# Altium project Base Station v1.PrjPcb
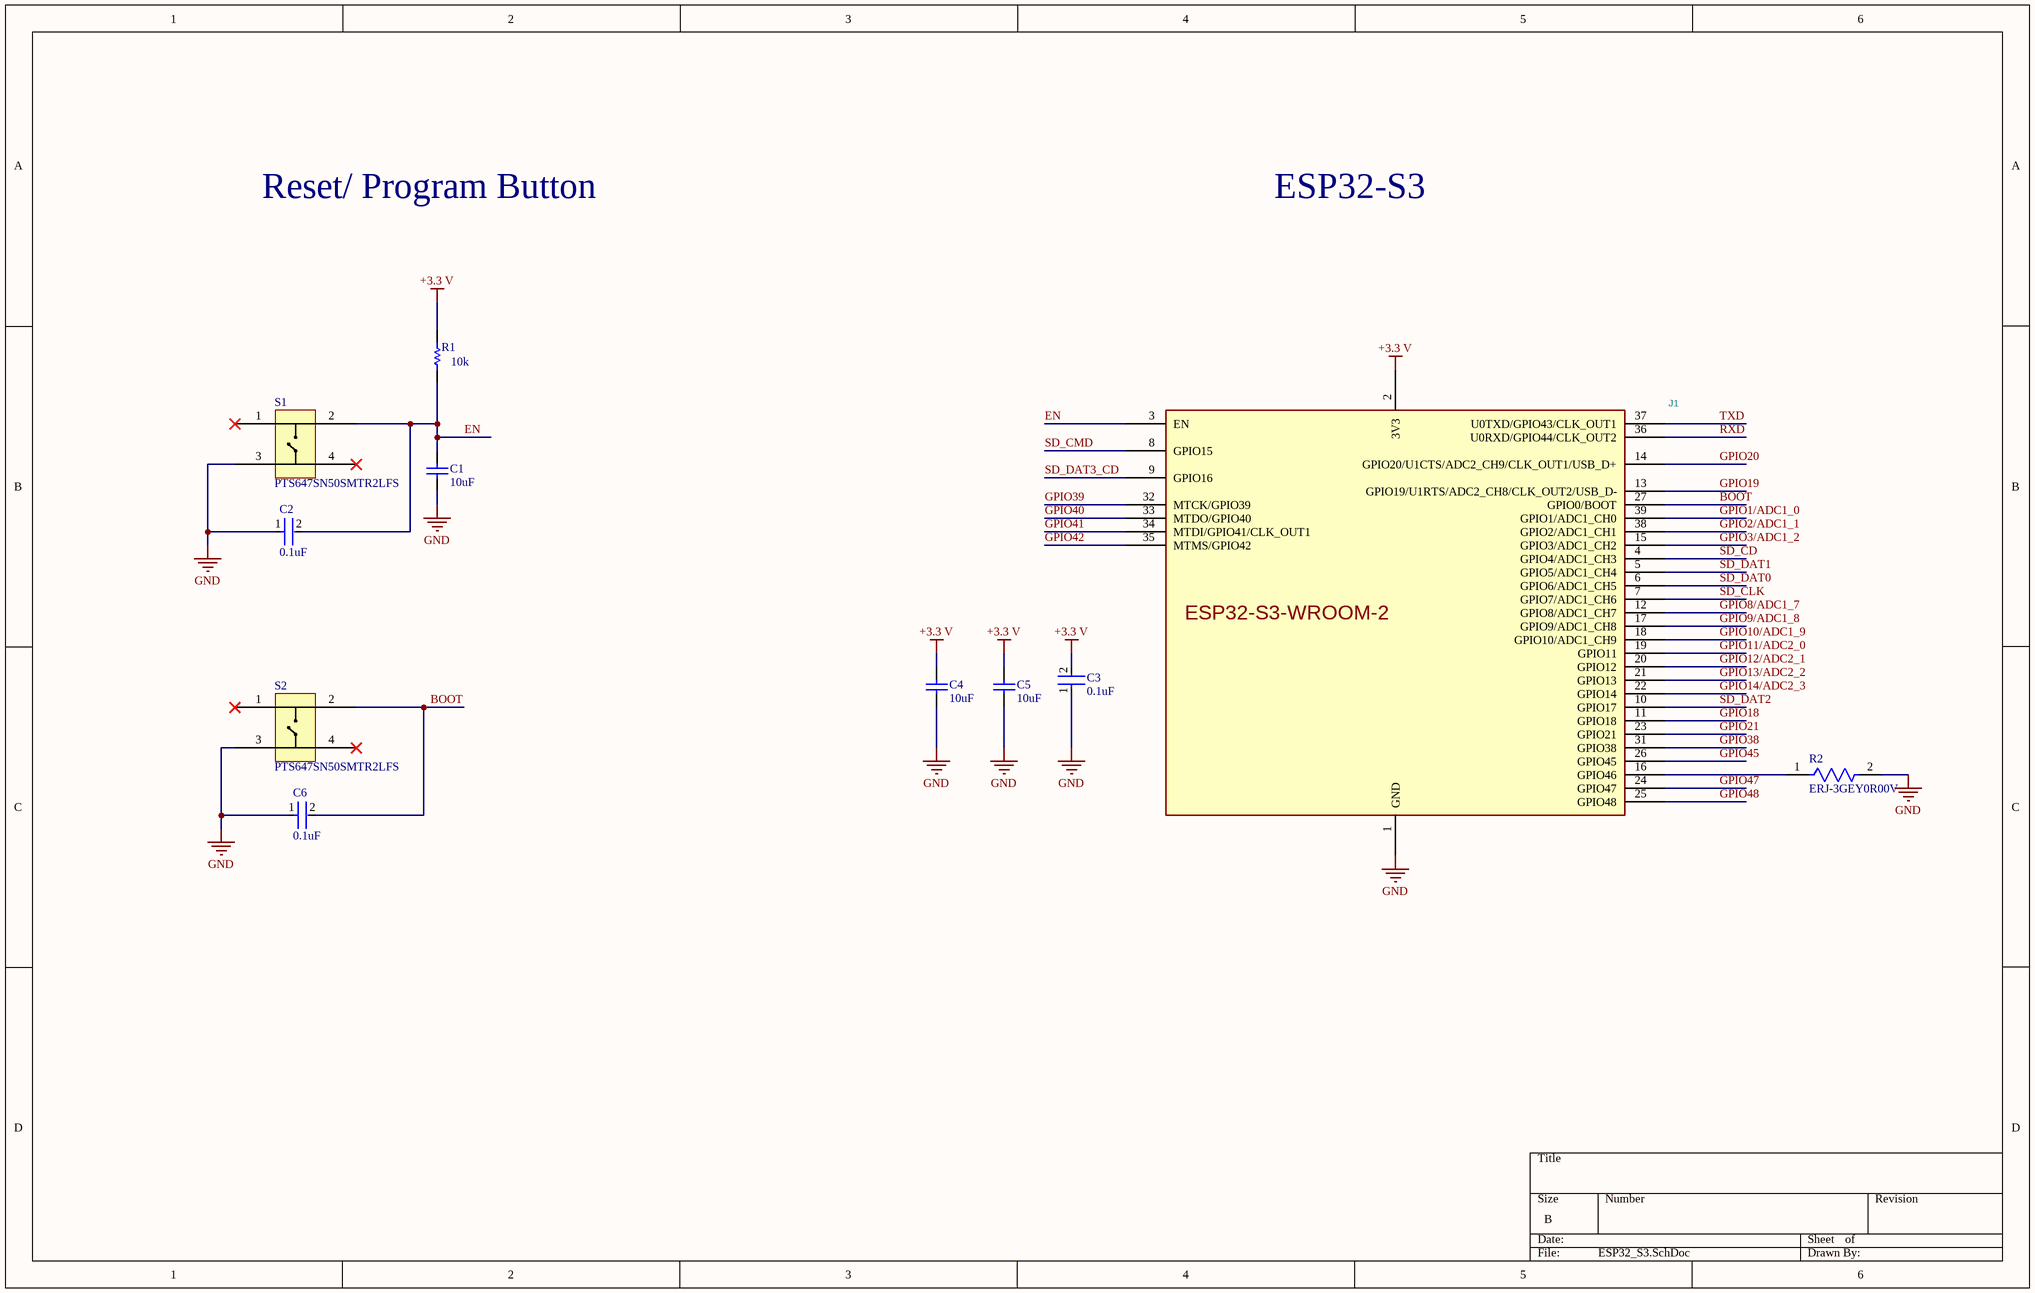
[diagram p0: ESP32_S3.SchDoc]
4 sheets, 51 parts. Net scope: global (net labels, ports and power ports of the same name join across sheets).
Board file: Base Station v1.PcbDoc
Sheets:
  ESP32_S3.SchDoc
  IO.SchDoc
  Power and CAN Bus.SchDoc
  CAN Bus Network.SchDoc

## Sheet ESP32_S3.SchDoc
size B; SheetNumber: 1; SheetTotal: 4

### Parts
C1  10uF  [CC0805ZKY5V6BB106-Footprint-1]
C2  0.1uF  [FP-CC0603-DA-IPC_A]
C3  0.1uF  [FP-CC0603-DA-IPC_A]
C4  10uF  [CC0805ZKY5V6BB106-Footprint-1]
C5  10uF  [CC0805ZKY5V6BB106-Footprint-1]
C6  0.1uF  [FP-CC0603-DA-IPC_A]
J1  ESP32-S3-WROOM-2  [ESP32-S3-WROOM-2]  (value not drawn)
R1  10k  [RESC2013X60X35ML10T20]
R2  ERJ-3GEY0R00V  [FP-ERJ-3GEY0R00V-IPC_A]
S1  PTS647SN50SMTR2LFS  [PTS647SN50SMTR2LFS-Footprint-1]
S2  PTS647SN50SMTR2LFS  [PTS647SN50SMTR2LFS-Footprint-1]

### Nets
+3.3 V: C3.2 C4.2 C5.2 J1.2(3V3) R1.2
GND: C1.1 C2.1 C3.1 C4.1 C5.1 C6.1 J1.1(GND) R2.2 S1.3 S2.3
BOOT: C6.2 J1.27(GPIO0/BOOT) S2.2
EN: C1.2 C2.2 J1.3(EN) R1.1 S1.2
GPIO1/ADC1_0: J1.39(GPIO1/ADC1_CH0)
GPIO2/ADC1_1: J1.38(GPIO2/ADC1_CH1)
GPIO3/ADC1_2: J1.15(GPIO3/ADC1_CH2)
GPIO8/ADC1_7: J1.12(GPIO8/ADC1_CH7)
GPIO9/ADC1_8: J1.17(GPIO9/ADC1_CH8)
GPIO10/ADC1_9: J1.18(GPIO10/ADC1_CH9)
GPIO11/ADC2_0: J1.19(GPIO11)
GPIO12/ADC2_1: J1.20(GPIO12)
GPIO13/ADC2_2: J1.21(GPIO13)
GPIO14/ADC2_3: J1.22(GPIO14)
GPIO18: J1.11(GPIO18)
GPIO19: J1.13(GPIO19/U1RTS/ADC2_CH8/CLK_OUT2/USB_D-)
GPIO20: J1.14(GPIO20/U1CTS/ADC2_CH9/CLK_OUT1/USB_D+)
GPIO21: J1.23(GPIO21)
GPIO38: J1.31(GPIO38)
GPIO39: J1.32(MTCK/GPIO39)
GPIO40: J1.33(MTDO/GPIO40)
GPIO41: J1.34(MTDI/GPIO41/CLK_OUT1)
GPIO42: J1.35(MTMS/GPIO42)
GPIO45: J1.26(GPIO45)
GPIO47: J1.24(GPIO47)
GPIO48: J1.25(GPIO48)
RXD: J1.36(U0RXD/GPIO44/CLK_OUT2)
SD_CD: J1.4(GPIO4/ADC1_CH3)
SD_CLK: J1.7(GPIO7/ADC1_CH6)
SD_CMD: J1.8(GPIO15)
SD_DAT0: J1.6(GPIO6/ADC1_CH5)
SD_DAT1: J1.5(GPIO5/ADC1_CH4)
SD_DAT2: J1.10(GPIO17)
SD_DAT3_CD: J1.9(GPIO16)
TXD: J1.37(U0TXD/GPIO43/CLK_OUT1)
NetJ1_16: J1.16(GPIO46) R2.1

Not connected (* = marked no-connect by the designer): J1 28(NC) 29(NC) 30(NC) 40(GND) 41(GND); S1 1* 4*; S2 1* 4*

### Notes on the sheet
- Reset/ Program Button
- ESP32-S3

### Library data of the parts
C1 C4 C5 = CMP-00010-2: Ceramic Capacitor, Multilayer, Ceramic, 10V, 80% +Tol, 20% -Tol, Y5V, -82/+22% TC, 10uF, Surface Mount, 0805; Multilayer: Yes; Min Operating Temperature: -30°C; Case/Package: 0805; Package Shape: Rectangular; RoHS Compliant: Yes; Termination: Wraparound; Package Style: SMTMeter; Packaging: Tape and Reel; Temperature Characteristics Code: Y5V; Pins: 2; Capacitor Type: Ceramic; Terminal Finish: Nickel; Tolerance (fill in as +-): 80%; Value: 10uF; Max Operating Temperature: 85°C; Length: 2mm; Width: 1.25mm; Dielectric Material: Ceramic; JESD-609 Code: e3; Reach SVHC Compliant: Yes; Height: 1.25mm; Tolerance  (fill in as +-): 20%; Mounting Technology: Surface Mount; Rated DC Voltage (URdc): 10V
C2 C3 C6 = CMP-00002-1: Ceramic Capacitor, Multilayer, Ceramic, 50V, 10% +Tol, 10% -Tol, X7R, 15% TC, 0.1uF, Surface Mount, 0603; Value: 100nF; Multilayer: Yes; Reach SVHC Compliant: Yes; Temperature Characteristics Code: X7R; Package Style: SMTMeter; Max Operating Temperature: 125°C; Dielectric Material: Ceramic; Mounting Technology: Surface Mount; Packaging: Tape and Reel; Width: 0.8mm; Min Operating Temperature: -55°C; Height: 0.8mm; RoHS Compliant: Yes; Rated DC Voltage (URdc): 50V; Tolerance (fill in as +-): 10%; Terminal Finish: Nickel; Case/Package: 0603; Length: 1.6mm; Tolerance  (fill in as +-): 10%; JESD-609 Code: e3; Package Shape: Rectangular; Capacitor Type: Ceramic; Pins: 2; Termination: Wraparound
J1 = CMP-024-000000-6: Reference: U; ki_description: 2.4 GHz WiFi (802.11 b/g/n) and Bluetooth ® 5 (LE) module Built around ESP32S3 series of SoCs, Xtensa ® dualcore 32bit LX7 microprocessor Flash up to 16 MB, PSRAM up to 8 MB 36 GPIOs, rich set of peripherals Onboard PCB antenna; Value: ESP32-S3-WROOM-2; Source: ESP32S3.SchLib; Datasheet: https://www.espressif.com/sites/default/files/documentation/esp32-s3-wroom-2_datasheet_en.pdf; Design Item ID: ESP32-S3-WROOM-2
R1 = CMP-00012-1: Fixed Resistor, Metal Glaze/thick Film, 0.125W, 10000ohm, 150V, 1% +/-Tol, 100ppm/Cel, Surface Mount, 0805; Package Width: 1.25mm; Rated Temperature: 70°C; Package Height: 0.5mm; Power: 125mW; Additional Feature: LASER TRIMMABLE; Temperature Coefficient: 100ppm/°C; Value: 10kR; Package Length: 2mm; Min Operating Temperature: -55°C; Working Voltage: 150V; Case/Package: 0805; Construction: Chip; Termination: Wraparound; Package Shape: Rectangular; Packaging: Tape and Reel; Technology: METAL GLAZE/THICK FILM; RoHS Compliant: Yes; Tolerance: 1%; Reach SVHC Compliant: Yes; Mounting Technology: Surface Mount; Pins: 2; Terminal Finish: Nickel; JESD-609 Code: e3; Max Operating Temperature: 155°C; Package Style: SMTMeter; Resistor Type: FIXED RESISTOR
R2 = CMP-00039-1: Fixed Resistor, Metal Glaze/thick Film, 0.1W, 0ohm, Surface Mount, 0603; Reference Standard: AEC-Q200; Power: 100mW; Rated Temperature: 70°C; Value: 0R; Package Height: 0.45mm; Package Width: 0.8mm; Package Length: 1.6mm; Package Style: SMTMeter; Mounting Technology: Surface Mount; Construction: Rectangular; Case/Package: 0603; Packaging: Tape and Reel; Resistor Type: FIXED RESISTOR; Reach SVHC Compliant: Yes; JESD-609 Code: e3; Package Shape: Rectangular; Technology: METAL GLAZE/THICK FILM; Min Operating Temperature: -55°C; Max Operating Temperature: 155°C; Pins: 2; Termination: Wraparound; Terminal Finish: Nickel; RoHS Compliant: Yes
S1 S2 = CMP-011-00013-3: Keypad Switch, 1 Switches, SPST, Momentary-tactile, 0.05A, 12VDC, 1.47N, Solder Terminal, Surface Mount-straight; RoHS Compliant: Yes

## Sheet IO.SchDoc
size B; SheetNumber: 2; SheetTotal: 4
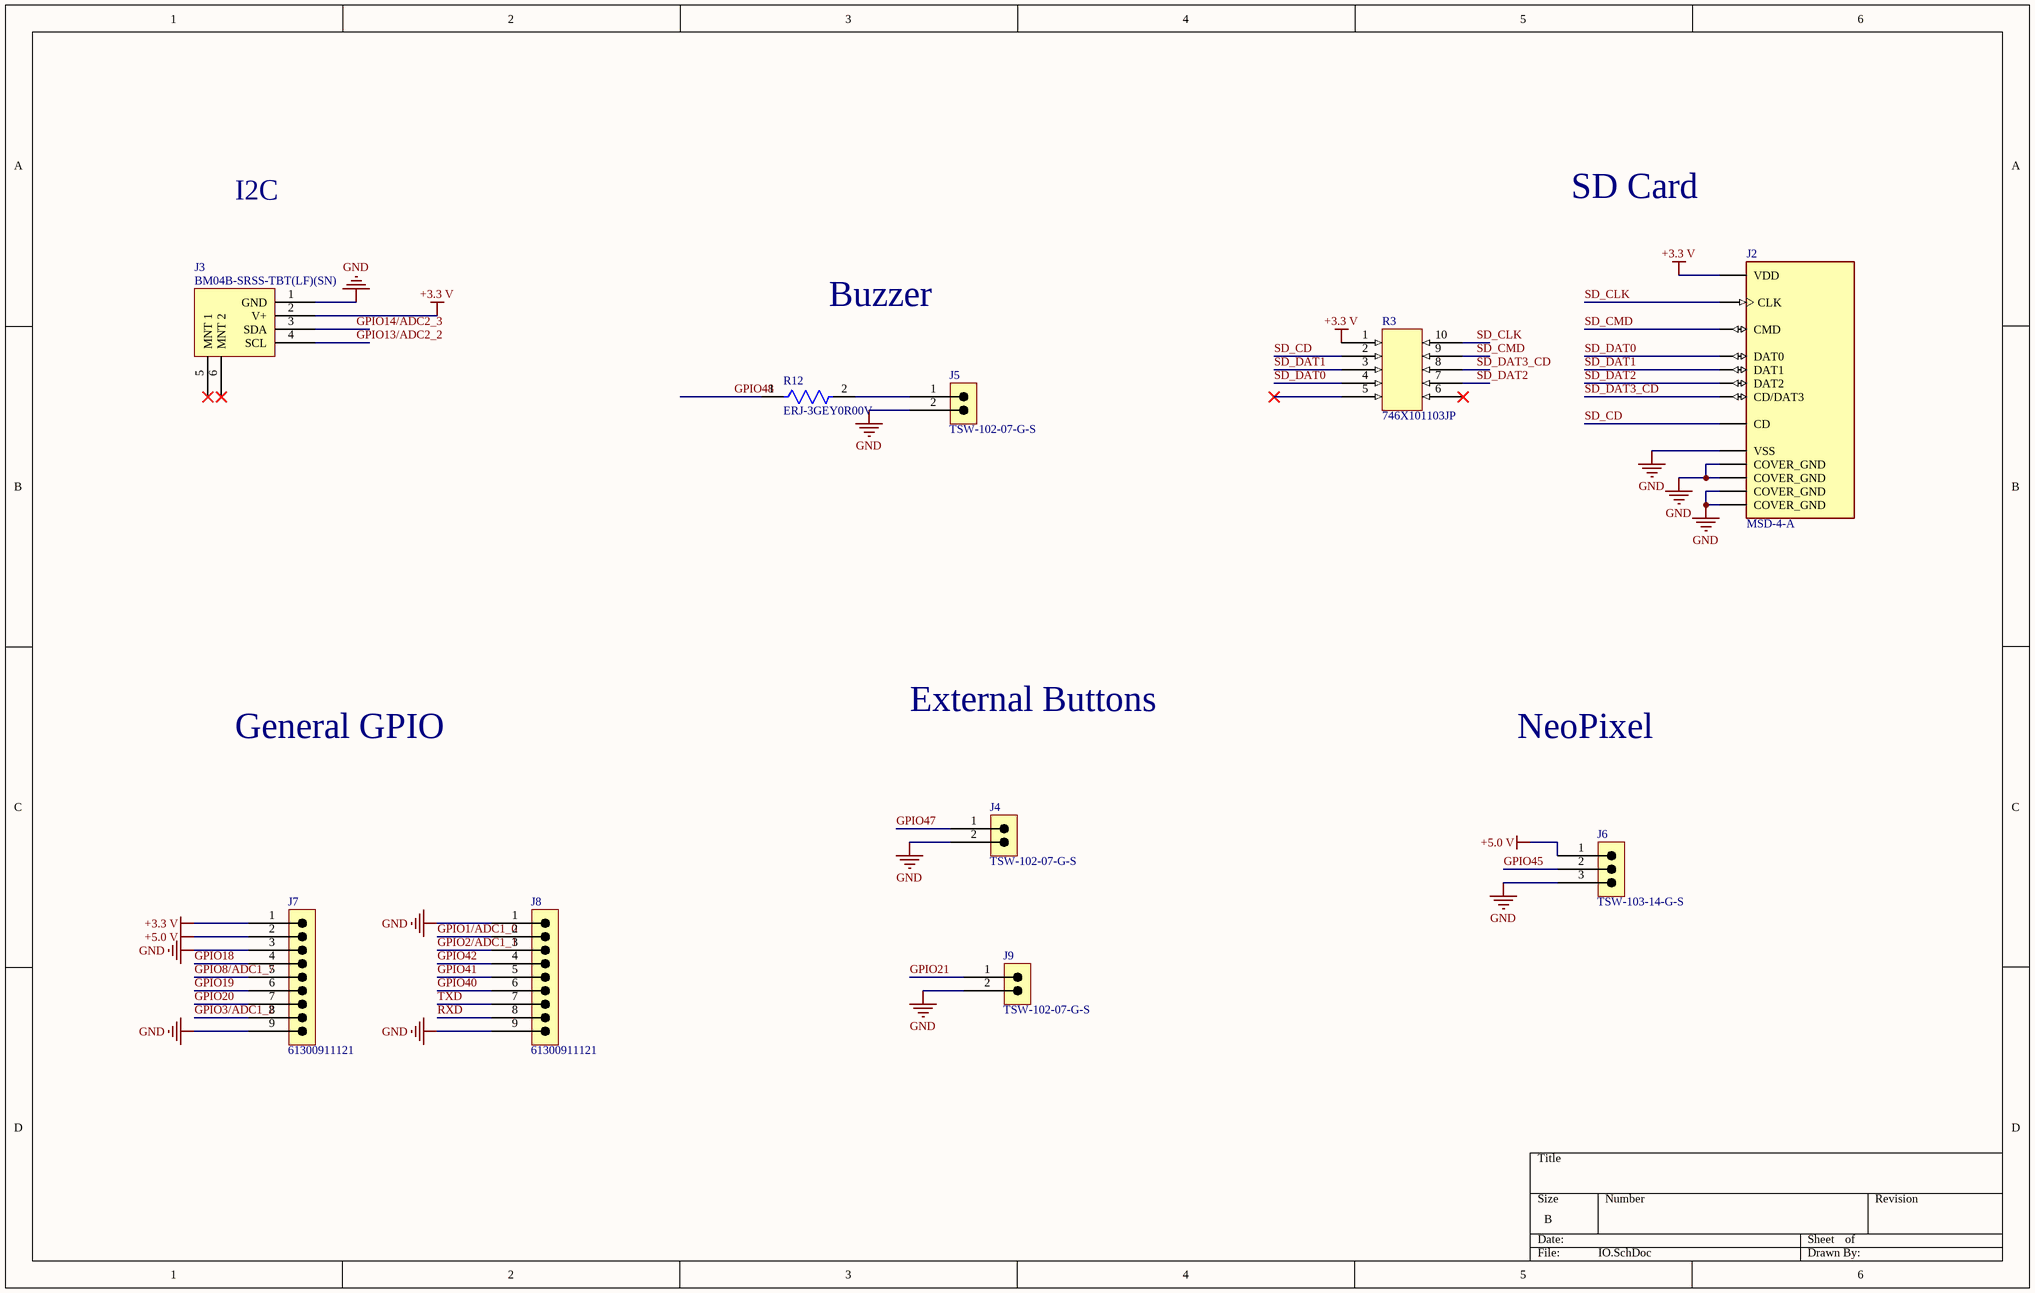
[diagram p1: IO.SchDoc]

### Parts
J2  MSD-4-A  [CUI_MSD-4-A]
J3  BM04B-SRSS-TBT(LF)(SN)  [FP-BM04B-SRSS-TBT_LF_SN-MFG]
J4  TSW-102-07-G-S  [FP-TSW-102-07-G-S-MFG]
J5  TSW-102-07-G-S  [FP-TSW-102-07-G-S-MFG]
J6  TSW-103-14-G-S  [FP-TSW-103-14-G-S-MFG]
J7  61300911121  [61300911121]
J8  61300911121  [61300911121]
J9  TSW-102-07-G-S  [FP-TSW-102-07-G-S-MFG]
R3  746X101103JP  [CAF-127P640X310-10N]
R12  ERJ-3GEY0R00V  [FP-ERJ-3GEY0R00V-IPC_A]

### Nets
+3.3 V: J2.4(VDD) J3.2(V+) J7.1 R3.1
+5.0 V: J6.1 J7.2
GND: J2.6(VSS) J2.G1(COVER_GND) J2.G2(COVER_GND) J2.G3(COVER_GND) J2.G4(COVER_GND) J3.1(GND) J4.2 J5.2 J6.3 J7.3 J7.9 J8.1 J8.9 J9.2
GPIO1/ADC1_0: J8.2
GPIO2/ADC1_1: J8.3
GPIO3/ADC1_2: J7.8
GPIO8/ADC1_7: J7.5
GPIO13/ADC2_2: J3.4(SCL)
GPIO14/ADC2_3: J3.3(SDA)
GPIO18: J7.4
GPIO19: J7.6
GPIO20: J7.7
GPIO21: J9.1
GPIO40: J8.6
GPIO41: J8.5
GPIO42: J8.4
GPIO45: J6.2
GPIO47: J4.1
GPIO48: R12.1
RXD: J8.8
SD_CD: J2.CD R3.2
SD_CLK: J2.5(CLK) R3.10
SD_CMD: J2.3(CMD) R3.9
SD_DAT0: J2.7(DAT0) R3.4
SD_DAT1: J2.8(DAT1) R3.3
SD_DAT2: J2.1(DAT2) R3.7
SD_DAT3_CD: J2.2(CD/DAT3) R3.8
TXD: J8.7
NetJ5_1: J5.1 R12.2

Not connected (* = marked no-connect by the designer): J3 5(MNT_1)* 6(MNT_2)*; R3 5* 6*

### Notes on the sheet
- I2C
- SD Card
- Buzzer
- General GPIO
- External Buttons
- NeoPixel

### Library data of the parts
J2 = CMP-002-00078-2: Micro SD Card Connector, 9 Positions, Connector and Ejector, Push In, Auto Eject Out, Surface Mount, 1.8 mm Height Above Board, Gold Flash; MF: CUI Devices; Source: MSD-4-A.SchLib; CUI_purchase_URL: https://www.cuidevices.com/product/interconnect/connectors/memory-card-connectors/sd-card-connectors/msd-4-a?utm_source=snapeda.com&utm_medium=referral&utm_campaign=snapedaBOM; Component Type: Standard; Value: *; Case/Package: None; SnapEDA_Link: https://www.snapeda.com/parts/MSD-4-A/CUI+Devices/view-part/?ref=snap; Pins: 13; MP: MSD-4-A; Check_prices: https://www.snapeda.com/parts/MSD-4-A/CUI+Devices/view-part/?ref=eda; Design Item ID: MSD-4-A
J3 = CMP-002-00076-4: 1.0mm Pitch, Ultra-Compact, Low Profile Design, Interchangeable Shrouded Header
J4 J5 J9 = CMP-00020-2: Board Connector, 2 Contact(s), 1 Row(s), Male, Straight, 0.1 inch Pitch, Solder Terminal, Black Insulator; Additional Feature: E.L.P.; Mixed Contacts: No; Plating Thickness: 10uin; Reliability: COMMERCIAL; Number of Rows Loaded: 1; Option: General Purpose; Number of Contacts: 2; Body/Shell Style: RECEPTACLE; PCB Contact Pattern: RECTANGULAR; Contact Style: SQ PIN-SKT; Mating Information: MULTIPLE MATING PARTS AVAILABLE; Reference Standard: UL; Mating Contact Pitch: 0.1inch; DIN Conformance: No; Terminal Length: 0.1inch; Flammability Rating: UL94 V-0; Body Depth: 0.1inch; Contact Finish - Termination: Gold (Au) - with Nickel (Ni) barrier; Body Breadth: 0.1inch; Reach SVHC Compliant: Yes; MIL Conformance: No; Contact Pattern: RECTANGULAR; Termination: Solder; Insulation Material: Glass; Insulation Color: Black; Terminal Pitch: 2.54mm; Filter Feature: No; Connector Type: BOARD CONNECTOR; Mounting Style: STRAIGHT; Contact Material: Bronze; Number Of Connectors: 1; Number Of PCB Rows: 1; IEC Conformance: No; Contact Finish - Mating: GOLD (10) OVER NICKEL (50); JESD-609 Code: e4; RoHS Compliant: Yes; Contact Gender: Male; Mounting Technology: Board
J6 = CMP-00025-3: Board Connector, 3 Contact(s), 1 Row(s), Male, Straight, 0.1 inch Pitch, Solder Terminal, Black Insulator, Receptacle; Additional Feature: E.L.P.; MIL Conformance: No; PCB Contact Pattern: RECTANGULAR; Mating Information: MULTIPLE MATING PARTS AVAILABLE; Number of Contacts: 3; Plating Thickness: 10uin; Reference Standard: UL; Reliability: COMMERCIAL; Contact Style: SQ PIN-SKT; Option: General Purpose; Number of Rows Loaded: 1; Contact Finish - Mating: GOLD (10) OVER NICKEL (50); Mounting Style: STRAIGHT; Reach SVHC Compliant: Yes; DIN Conformance: No; Filter Feature: No; Mixed Contacts: No; Body Depth: 0.1inch; Terminal Length: 0.11inch; Contact Pattern: RECTANGULAR; Contact Finish - Termination: Gold (Au) - with Nickel (Ni) barrier; Connector Type: BOARD CONNECTOR; Body Breadth: 0.1inch; Termination: Solder; Insulation Material: Glass; Body/Shell Style: RECEPTACLE; IEC Conformance: No; Insulation Color: Black; Contact Material: Bronze; RoHS Compliant: Yes; Mounting Technology: Board; Number Of Connectors: 1; Mating Contact Pitch: 0.1inch; JESD-609 Code: e4; Number Of PCB Rows: 1; Contact Gender: Male; Terminal Pitch: 2.54mm
J7 J8 = CMP-00023-4: Board Connector, 9 Contact(s), 1 Row(s), Male, Straight, 0.1 inch Pitch, Solder Terminal, Locking, Black Insulator, Plug; Rated Current (Signal): 3A; Body Length: 0.9inch; Reference Standard: UL; Reliability: COMMERCIAL; Contact Style: SQ PIN-SKT; PCB Contact Pattern: RECTANGULAR; Number of Contacts: 9; Insulation Resistance: 1GR; Dielectric Withstanding Voltage (AC): 500V; Number Of Connectors: 1; Contact Resistance: 20mR; Body/Shell Style: PLUG; Terminal Length: 0.118inch; Reach SVHC Compliant: Yes; Connector Type: BOARD CONNECTOR; Contact Finish - Termination: Gold (Au) - with Nickel (Ni) barrier; Body Depth: 0.1inch; Mounting Technology: Board; Terminal Pitch: 2.54mm; Body Breadth: 0.1inch; Max Operating Temperature: 125°C; Min Operating Temperature: -40°C; RoHS Compliant: Yes; Contact Material: Copper Alloy; Insulation Color: Black; Termination: Solder; Insulation Material: Polybutylene; Contact Finish - Mating: GOLD; Mounting Style: STRAIGHT; JESD-609 Code: e4; Mounting Option 1: LOCKING; Mating Contact Pitch: 0.1inch; Contact Pattern: RECTANGULAR; Number of Rows Loaded: 1; Contact Gender: Male
R3 = CMP-00038-1: Array/Network Resistor, Bussed, Metal Glaze/thick Film, 0.063W, 10000ohm, 25V, 5% +/-Tol, 200ppm/Cel, Surface Mount, 0612; Package Height: 0.6mm; Element Power Dissipation: 31mW; Value: 10kR; Package Length: 3.2mm; Number of Elements: 8; Package Width: 1.6mm; Rated Temperature: 70°C; Power: 248mW; Channels: 1; Temperature Coefficient: 200ppm/°C; Resistor Type: ARRAY/NETWORK RESISTOR; Working Voltage: 25V; RoHS Compliant: Yes; Min Operating Temperature: -55°C; Packaging: Tape and Reel; Package Style: SMTMeter; Case/Package: 0613; First Element Resistance: 10kR; Network Type: BUSSED; Package Shape: Rectangular; Reach SVHC Compliant: Yes; JESD-609 Code: e3; Pins: 10; Construction: Chip; Terminal Finish: Nickel; Mounting Technology: Surface Mount; Technology: METAL GLAZE/THICK FILM; Max Operating Temperature: 125°C; Termination: Wraparound; Tolerance: 5%
R12 = CMP-00039-1: as R2 on sheet ESP32_S3; Package Style: SMTMeter; Mounting Technology: Surface Mount; Construction: Rectangular; Case/Package: 0603; Packaging: Tape and Reel; Resistor Type: FIXED RESISTOR; Reach SVHC Compliant: Yes; JESD-609 Code: e3; Package Shape: Rectangular; Technology: METAL GLAZE/THICK FILM; Min Operating Temperature: -55°C; Max Operating Temperature: 155°C; Pins: 2; Termination: Wraparound; Terminal Finish: Nickel; RoHS Compliant: Yes

## Sheet Power and CAN Bus.SchDoc
size B; SheetNumber: 3; SheetTotal: 4
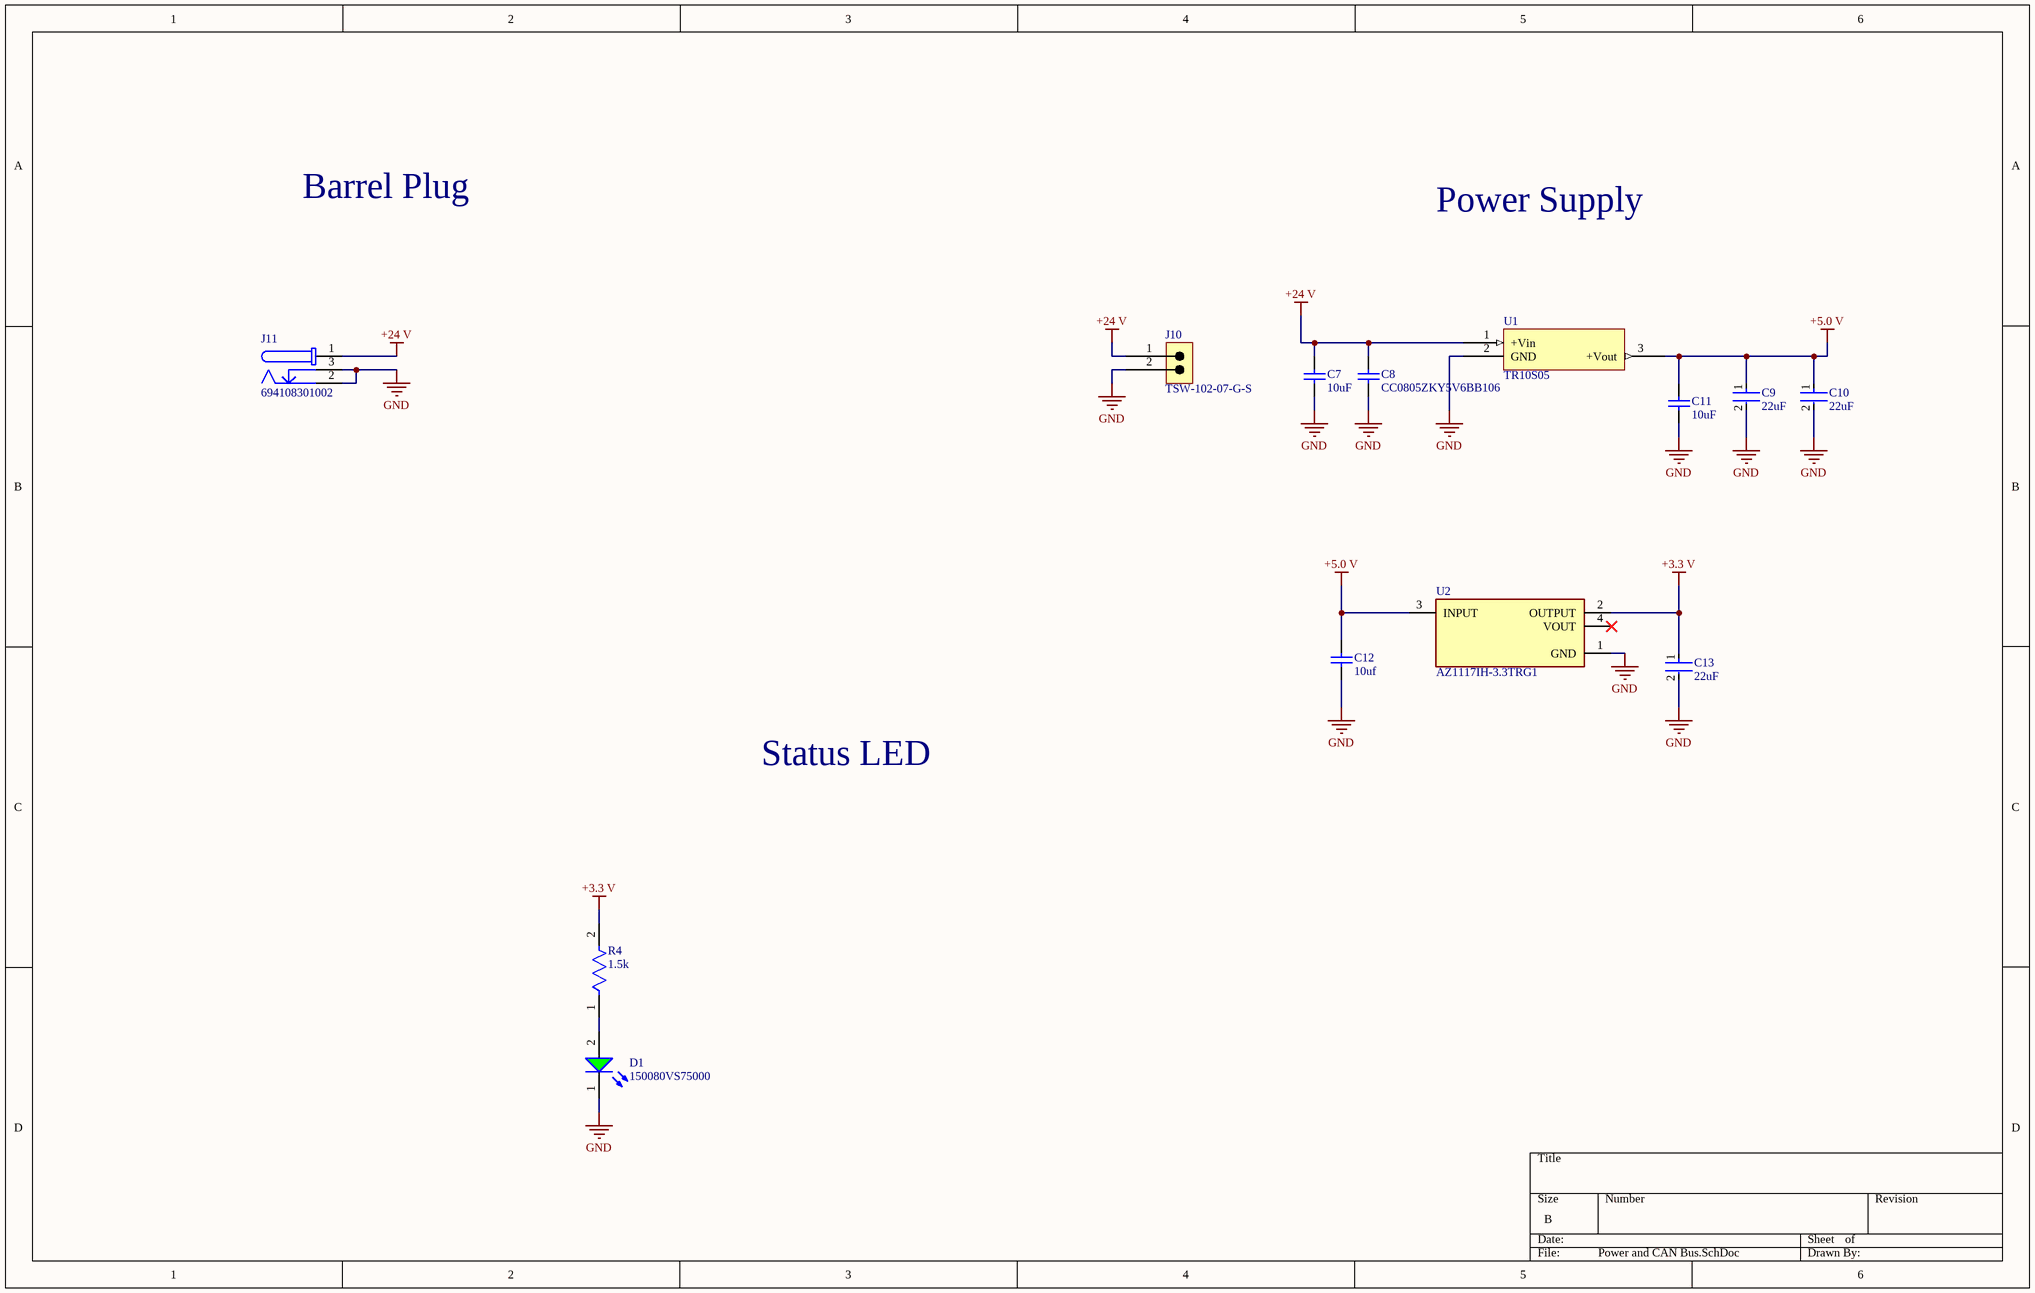
[diagram p2: Power and CAN Bus.SchDoc]

### Parts
C7  10uF  [CC0805ZKY5V6BB106-Footprint-1]
C8  CC0805ZKY5V6BB106  [CC0805ZKY5V6BB106-Footprint-1]
C9  22uF  [FP-GMC21R-IPC_B]
C10  22uF  [FP-GMC21R-IPC_B]
C11  10uF  [CC0805ZKY5V6BB106-Footprint-1]
C12  10uf  [CC0805ZKY5V6BB106-Footprint-1]
C13  22uF  [FP-GMC21R-IPC_B]
D1  150080VS75000  [WL-SMCW_0805_150080xx75000]
J10  TSW-102-07-G-S  [FP-TSW-102-07-G-S-MFG]
J11  694108301002  [694108301002]
R4  1.5k  [FP-RT0805-IPC_A]
U1  TR10S05  [TR10S05-Footprint-1]
U2  AZ1117IH-3.3TRG1  [FP-SOT223-IPC_B]

### Nets
+3.3 V: C13.1 R4.2 U2.2(OUTPUT)
+5.0 V: C9.1 C10.1 C11.2 C12.2 U1.3(+Vout) U2.3(INPUT)
+24 V: C7.2 C8.2 J10.1 J11.1 U1.1(+Vin)
GND: C7.1 C8.1 C9.2 C10.2 C11.1 C12.1 C13.2 D1.1(K) J10.2 J11.2 J11.3 U1.2(GND) U2.1(GND)
NetD1_2: D1.2(A) R4.1

Not connected (* = marked no-connect by the designer): U2 4(VOUT)*

### Notes on the sheet
- Barrel Plug
- Power Supply
- Status LED

### Library data of the parts
C7 C8 C11 C12 = CMP-00010-2: as C1 on sheet ESP32_S3; Min Operating Temperature: -30°C; Case/Package: 0805; Package Shape: Rectangular; RoHS Compliant: Yes; Termination: Wraparound; Package Style: SMTMeter; Packaging: Tape and Reel; Temperature Characteristics Code: Y5V; Pins: 2; Capacitor Type: Ceramic; Terminal Finish: Nickel; Tolerance (fill in as +-): 80%; Value: 10uF; Max Operating Temperature: 85°C; Length: 2mm; Width: 1.25mm; Dielectric Material: Ceramic; JESD-609 Code: e3; Reach SVHC Compliant: Yes; Height: 1.25mm; Tolerance  (fill in as +-): 20%; Mounting Technology: Surface Mount; Rated DC Voltage (URdc): 10V
C9 C10 C13 = CMP-00027-1: Ceramic Capacitor, Multilayer, Ceramic, 35V, 20% +Tol, 20% -Tol, X5R, 15% TC, 22uF, Surface Mount, 0805
D1 = CMP-00021-1: Single Color LED, Bright Green, Water Clear, 1.4mm; Shape: Rectangular; Luminous Intensity-Nom: 40mcd; Viewing Angle: 140°; Channels: 1; Forward Current: 30mA; Overall Height: 0.7mm; RoHS Compliant: Yes; Max Operating Temperature: 85°C; Optoelectronic Device Type: SINGLE COLOR LED; Color: Green; Min Operating Temperature: -40°C; Terminal Pitch: 2.1mm; Mounting Technology: Surface Mount; Packaging: Tape and Reel; Reach SVHC Compliant: Yes; Size: 1.4mm; Lens Style: WATER CLEAR; Pins: 2
J10 = CMP-00020-2: as J4 on sheet IO; Mating Contact Pitch: 0.1inch; DIN Conformance: No; Terminal Length: 0.1inch; Flammability Rating: UL94 V-0; Body Depth: 0.1inch; Contact Finish - Termination: Gold (Au) - with Nickel (Ni) barrier; Body Breadth: 0.1inch; Reach SVHC Compliant: Yes; MIL Conformance: No; Contact Pattern: RECTANGULAR; Termination: Solder; Insulation Material: Glass; Insulation Color: Black; Terminal Pitch: 2.54mm; Filter Feature: No; Connector Type: BOARD CONNECTOR; Mounting Style: STRAIGHT; Contact Material: Bronze; Number Of Connectors: 1; Number Of PCB Rows: 1; IEC Conformance: No; Contact Finish - Mating: GOLD (10) OVER NICKEL (50); JESD-609 Code: e4; RoHS Compliant: Yes; Contact Gender: Male; Mounting Technology: Board
J11 = CMP-002-00075-2: DC Power Jack Connector WR-DC, Male, Right Angled, THT, 5 A, 24 V; Operating Supply Voltage: 24V; Shielding: Unshielded; Number of Contacts: 3; Pin Diameter: 2.5mm; Current Rating: 5A; Connector Type: Power,Jack; Voltage Rating (DC): 20V; Insulation Resistance: 100MR; Body Color: Black; Max Operating Temperature: 85°C; Gender: Male; Termination: Through Hole; Contact Plating: Tin; Contact Gender: Female; Packaging: Bulk; Series: WR-DC; Package Quantity: 500; Mounting Technology: Through Hole; Min Operating Temperature: -40°C; Housing Material: Polyamide; Flammability Rating: UL94 V-0; Reach SVHC Compliant: Unknown; Voltage Rating: 24V; Height: 11mm; Color: Black; RoHS Compliant: Yes; Contact Material: Copper Alloy
R4 = CMP-00013-1: Fixed Resistor, Thin Film, 0.125W, 1500ohm, 150V, 1% +/-Tol, 50ppm/Cel, Surface Mount, 0805; Package Width: 1.25mm; Package Height: 0.5mm; Additional Feature: HIGH PRECISION; Temperature Coefficient: 50ppm/°C; Power: 125mW; Rated Temperature: 70°C; Package Length: 2mm; Value: 1.5kR; Termination: Wraparound; Packaging: Tape and Reel; Reach SVHC Compliant: Yes; Pins: 2; Working Voltage: 150V; Construction: Chip; Package Style: SMTMeter; Max Operating Temperature: 155°C; Case/Package: 0805; Resistor Type: FIXED RESISTOR; Mounting Technology: Surface Mount; Technology: THIN FILM; Min Operating Temperature: -55°C; Tolerance: 1%; RoHS Compliant: Yes
U1 = CMP-019-00050-2: DC-DC Regulated Power Supply Module; Reach SVHC Compliant: Yes; RoHS Compliant: Yes; Throw Configuration: DC-DC REGULATED POWER SUPPLY MODULE
U2 = CMP-00028-1: Fixed Positive LDO Regulator, 3.3V, 1.3V Dropout, PDSO3; Output Voltage1-Min: 3.235V; Output Current1-Max: 800mA; Output Voltage1-Max: 3.365V; Channels: 1; Max Supply Voltage: 15V; Regulator Type: FIXED POSITIVE SINGLE OUTPUT LDO REGULATOR; Package Body Material: Plastic; Dropout Voltage1-Max: 1.3V; Surface Mount: Yes; Output Voltage1-Nom: 3.3V; Terminal Position: DUAL; Terminal Pitch: 2.3mm; RoHS Compliant: Yes; Case/Package: SOP; Reach SVHC Compliant: Yes; Length: 6.5mm; Operating Temperature, TJ-Max: 125°C; JESD-30 Code: R-PDSO-G3; Operating Temperature, TJ-Min: -40°C; Pins: 3; Height - Seated (Max): 1.8mm; Terminal Form: Gull Wing; Package Style: SMALL OUTLINEMeter; Package Shape: Rectangular; Width: 3.5mm

## Sheet CAN Bus Network.SchDoc
size B; SheetNumber: 4; SheetTotal: 4
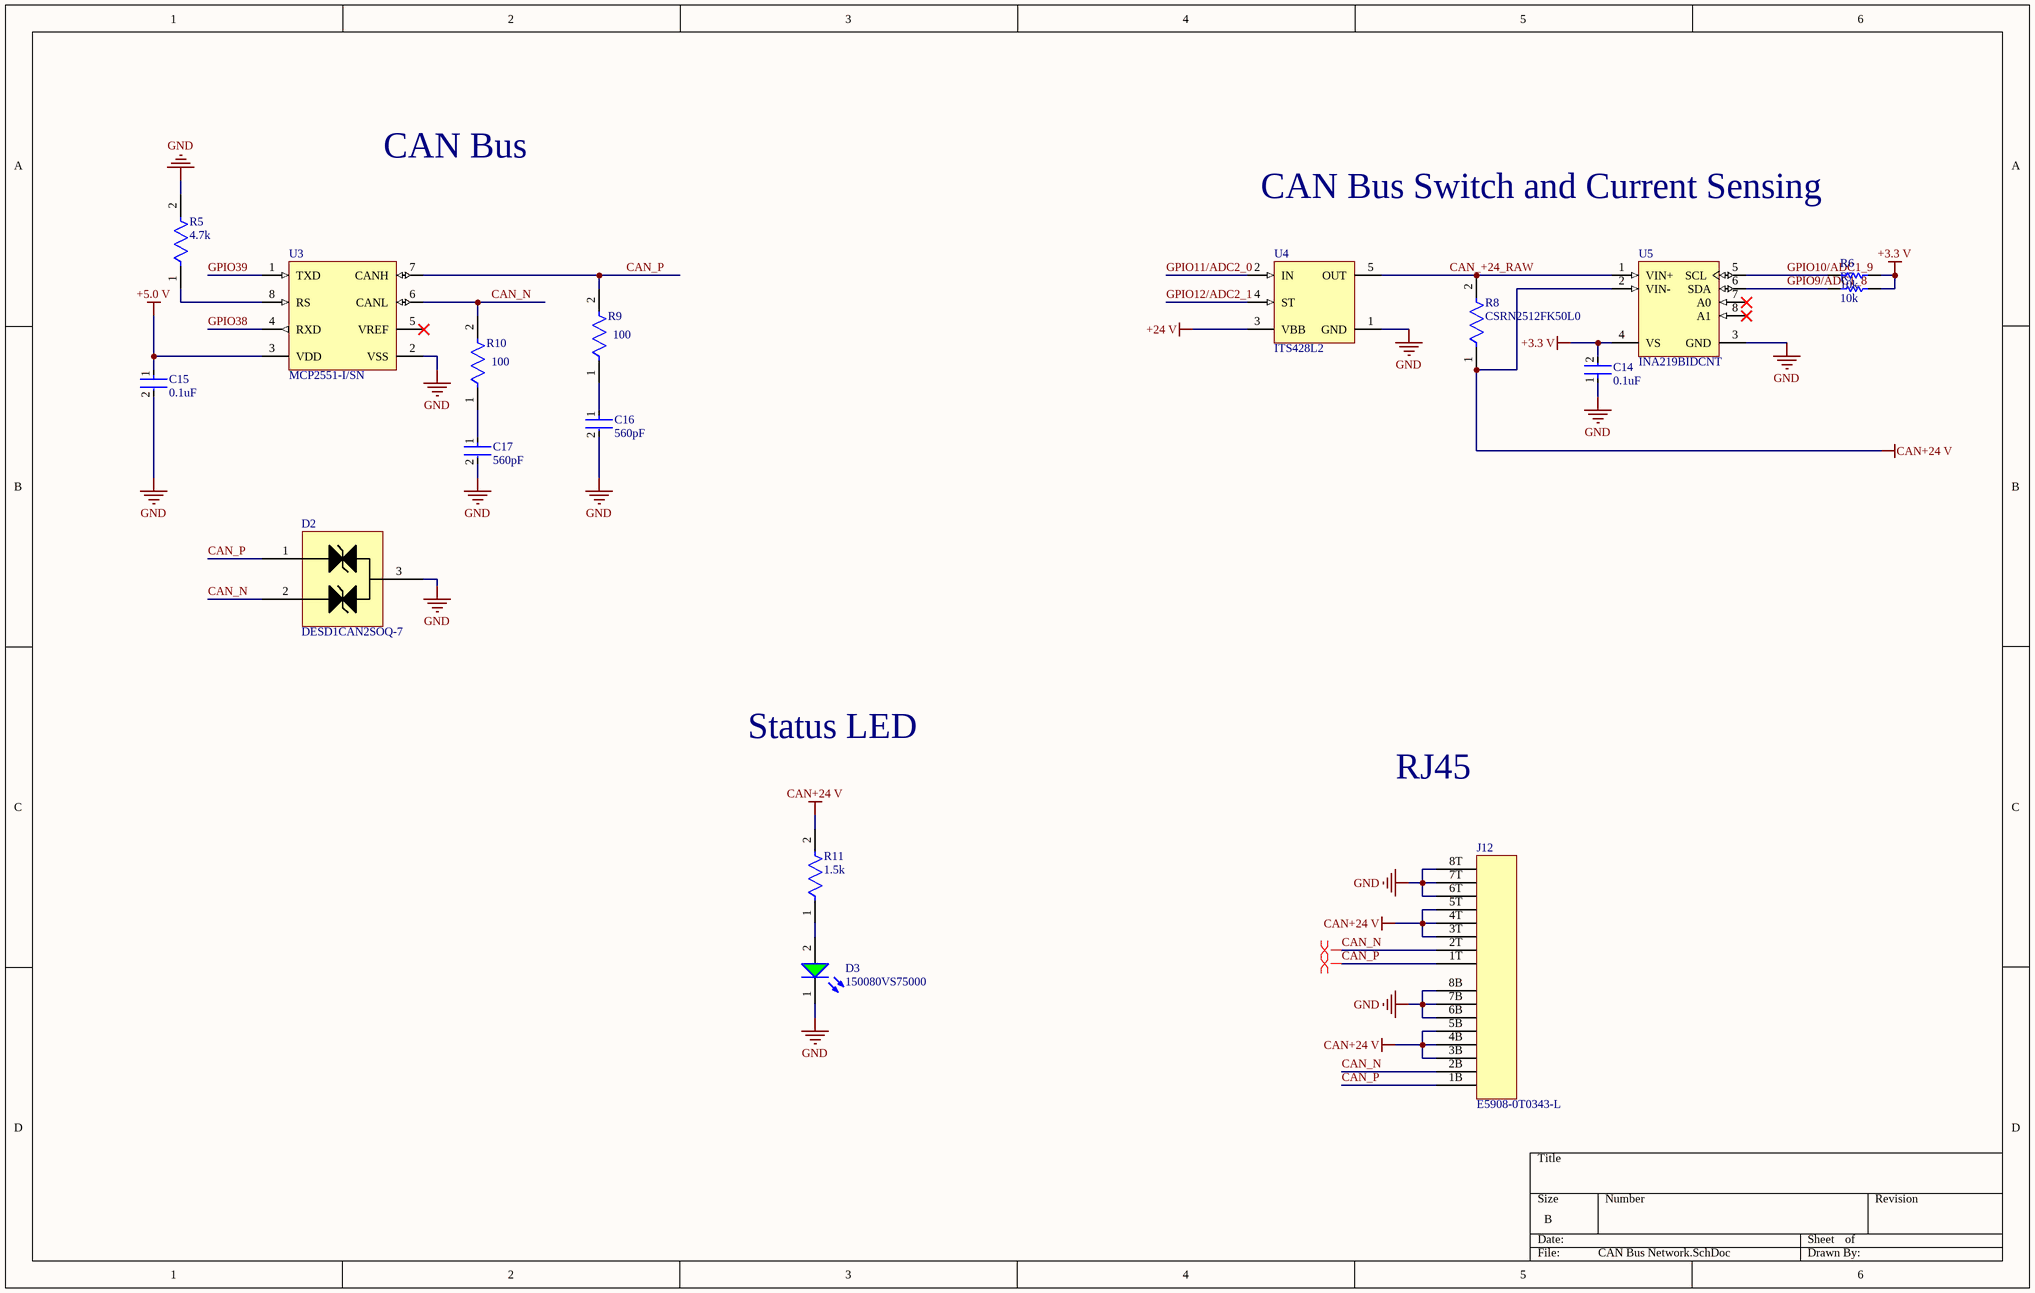
[diagram p3: CAN Bus Network.SchDoc]

### Parts
C14  0.1uF  [FP-CC0603-DA-IPC_A]
C15  0.1uF  [FP-CC0603-DA-IPC_A]
C16  560pF  [FP-CC1206-1_25-IPC_A]
C17  560pF  [FP-CC1206-1_25-IPC_A]
D2  DESD1CAN2SOQ-7  [SOT95P245X110-3N]
D3  150080VS75000  [WL-SMCW_0805_150080xx75000]
J12  E5908-0T0343-L  [E5908-0T0343-L-Footprint-1]
R5  4.7k  [FP-RT0805-IPC_A]
R6  10k  [RESC2013X60X35ML10T20]
R7  10k  [RESC2013X60X35ML10T20]
R8  CSRN2512FK50L0  [FP-CSRN2512-IPC_B]
R9  100  [FP-RT0805-0_6-IPC_A]
R10  100  [FP-RT0805-0_6-IPC_A]
R11  1.5k  [FP-RT0805-IPC_A]
U3  MCP2551-I/SN  [MCHP-SN8_V]
U4  ITS428L2  [INF-PG-TO252-5-11_M]
U5  INA219BIDCNT  [DCN0008A_M]

### Nets
+3.3 V: C14.2 R6.1 R7.1 U5.4(VS)
+5.0 V: C15.1 U3.3(VDD)
+24 V: U4.3(VBB)
CAN+24 V: J12.3B J12.3T J12.4B J12.4T J12.5B J12.5T R8.1 R11.2 U5.2(VIN-)
GND: C14.1 C15.2 C16.2 C17.2 D2.3 D3.1(K) J12.6B J12.6T J12.7B J12.7T J12.8B J12.8T R5.2 U3.2(VSS) U4.1(GND) U5.3(GND)
CAN_+24_RAW: R8.2 U4.5(OUT) U5.1(VIN+)
CAN_N: D2.2 J12.2B J12.2T R10.2 U3.6(CANL)
CAN_P: D2.1 J12.1B J12.1T R9.2 U3.7(CANH)
GPIO9/ADC1_8: R7.2 U5.6(SDA)
GPIO10/ADC1_9: R6.2 U5.5(SCL)
GPIO11/ADC2_0: U4.2(IN)
GPIO12/ADC2_1: U4.4(ST)
GPIO38: U3.4(RXD)
GPIO39: U3.1(TXD)
NetC16_1: C16.1 R9.1
NetC17_1: C17.1 R10.1
NetD3_2: D3.2(A) R11.1
NetR5_1: R5.1 U3.8(RS)

Not connected (* = marked no-connect by the designer): U3 5(VREF)*; U5 7(A0)* 8(A1)*

### Layout directives
differential pair: CAN_N, CAN_P

### Notes on the sheet
- CAN Bus
- CAN Bus Switch and Current Sensing
- Status LED
- RJ45

### Library data of the parts
C14 C15 = CMP-00002-1: as C2 on sheet ESP32_S3; Reach SVHC Compliant: Yes; Temperature Characteristics Code: X7R; Package Style: SMTMeter; Max Operating Temperature: 125°C; Dielectric Material: Ceramic; Mounting Technology: Surface Mount; Packaging: Tape and Reel; Width: 0.8mm; Min Operating Temperature: -55°C; Height: 0.8mm; RoHS Compliant: Yes; Rated DC Voltage (URdc): 50V; Tolerance (fill in as +-): 10%; Terminal Finish: Nickel; Case/Package: 0603; Length: 1.6mm; Tolerance  (fill in as +-): 10%; JESD-609 Code: e3; Package Shape: Rectangular; Capacitor Type: Ceramic; Pins: 2; Termination: Wraparound
C16 C17 = CMP-00008-1: Ceramic Capacitor, Multilayer, Ceramic, 50V, 10% +Tol, 10% -Tol, X7R, 15% TC, 0.00056uF, Surface Mount, 1206; Multilayer: Yes; Terminal Finish: Tin; Tolerance  (fill in as +-): 10%; Case/Package: 1206; Max Operating Temperature: 125°C; Packaging: Tape and Reel; Min Operating Temperature: -55°C; Mounting Technology: Surface Mount; Rated DC Voltage (URdc): 50V; Pins: 2; Capacitor Type: Ceramic; RoHS Compliant: Yes; Reach SVHC Compliant: Yes; Tolerance (fill in as +-): 10%; Package Shape: Rectangular; Termination: Wraparound; Dielectric Material: Ceramic; Temperature Characteristics Code: X7R; Value: 560pF; JESD-609 Code: e3
D2 = CMP-00024-2: Trans Voltage Suppressor Diode, 200W, 24V V(RWM), Bidirectional, 2 Element, Silicon; Time @ Peak Reflow Temperature-Max (s): 30s; Reference Standard: AEC-Q101; Max Power Dissipation: 300mW; Min Breakdown Voltage: 25.4V; Number of Elements: 2; Additional Feature: HIGH RELIABILITY; Max Breakdown Voltage: 30.3V; Package Body Material: Plastic; Technology: AVALANCHE; JESD-30 Code: R-PDSO-G3; Reach SVHC Compliant: Yes; RoHS Compliant: Yes; Min Operating Temperature: -65°C; JESD-609 Code: e3; Surface Mount: Yes; Max Operating Temperature: 150°C; Pins: 3; Terminal Position: DUAL; Package Shape: Rectangular; Polarity: Bidirectional; Non-rep Peak Rev Power Dis-Max: 200W; Moisture Sensitivity Level: 1; Terminal Finish: Tin; Package Style: SMALL OUTLINEMeter; Peak Reflow Temperature (Cel): 260°C; Rep Pk Reverse Voltage-Max: 24V; Terminal Form: Gull Wing; Diode Type: TRANS VOLTAGE SUPPRESSOR; Diode Element Material: SILICON
D3 = CMP-00021-1: as D1 on sheet Power and CAN Bus; RoHS Compliant: Yes; Max Operating Temperature: 85°C; Optoelectronic Device Type: SINGLE COLOR LED; Color: Green; Min Operating Temperature: -40°C; Terminal Pitch: 2.1mm; Mounting Technology: Surface Mount; Packaging: Tape and Reel; Reach SVHC Compliant: Yes; Size: 1.4mm; Lens Style: WATER CLEAR; Pins: 2
J12 = CMP-002-00077-7: Telecom and Datacom Connector, 16 Contact(s), Female, Right Angle, Solder Terminal, Jack; Manufacturer Series: E5908; Mixed Contacts: No; Number of Contacts: 16; Option: General Purpose; RoHS Compliant: Yes; Contact Finish - Mating: GOLD (15) OVER NICKEL; Shell Material: Glass; Body/Shell Style: JACK; Mounting Technology: Board; Contact Gender: Female; Termination: Solder; JESD-609 Code: e4; Filter Feature: No; Mounting Style: RIGHT ANGLE; IEC Conformance: No; Reach SVHC Compliant: Yes; Flammability Rating: UL94 V-0; DIN Conformance: No; Contact Finish - Termination: GOLD (15) OVER NICKEL; Insulation Material: Glass; Empty Shell: No; MIL Conformance: No; Connector Type: TELECOM AND DATACOM CONNECTOR
R5 = CMP-00015-1: Fixed Resistor, Thin Film, 0.125W, 4700ohm, 150V, 1% +/-Tol, 50ppm/Cel, Surface Mount, 0805; Temperature Coefficient: 50ppm/°C; Package Height: 0.5mm; Rated Temperature: 70°C; Power: 125mW; Additional Feature: HIGH PRECISION; Value: 4.7kR; Package Length: 2mm; Package Width: 1.25mm; Construction: Chip; Resistor Type: FIXED RESISTOR; Pins: 2; Reach SVHC Compliant: Yes; Tolerance: 1%; Package Style: SMTMeter; Packaging: Tape and Reel; RoHS Compliant: Yes; Termination: Wraparound; Mounting Technology: Surface Mount; Case/Package: 0805; Max Operating Temperature: 155°C; Technology: THIN FILM; Min Operating Temperature: -55°C; Working Voltage: 150V
R6 R7 = CMP-00012-1: as R1 on sheet ESP32_S3; Min Operating Temperature: -55°C; Working Voltage: 150V; Case/Package: 0805; Construction: Chip; Termination: Wraparound; Package Shape: Rectangular; Packaging: Tape and Reel; Technology: METAL GLAZE/THICK FILM; RoHS Compliant: Yes; Tolerance: 1%; Reach SVHC Compliant: Yes; Mounting Technology: Surface Mount; Pins: 2; Terminal Finish: Nickel; JESD-609 Code: e3; Max Operating Temperature: 155°C; Package Style: SMTMeter; Resistor Type: FIXED RESISTOR
R8 = CMP-00034-1: Fixed Resistor, Metal Glaze/thick Film, 2W, 0.05ohm, 1% +/-Tol, 200ppm/Cel, Surface Mount, 2512; Temperature Coefficient: 200ppm/°C; Rated Temperature: 70°C; Package Height: 0.6mm; Package Width: 3.15mm; Value: 50mR; Package Length: 6.35mm; Package Style: SMTMeter; Terminal Finish: Nickel; RoHS Compliant: Yes; Power: 2W; Pins: 2; Package Shape: Rectangular; Construction: Rectangular; Resistor Type: FIXED RESISTOR; Case/Package: 2512; Max Operating Temperature: 155°C; Tolerance: 1%; JESD-609 Code: e3; Technology: METAL GLAZE/THICK FILM; Packaging: Tape and Reel; Mounting Technology: Surface Mount; Reach SVHC Compliant: Yes; Min Operating Temperature: -55°C; Termination: Wraparound
R9 R10 = CMP-00016-1: Fixed Resistor, Thin Film, 0.125W, 100ohm, 150V, 0.1% +/-Tol, 25ppm/Cel, Surface Mount, 0805; Package Height: 0.5mm; Package Length: 2mm; Rated Temperature: 70°C; Temperature Coefficient: 25ppm/°C; Value: 100R; Power: 125mW; Additional Feature: HIGH PRECISION; Package Width: 1.25mm; Packaging: Tape and Reel; Max Operating Temperature: 155°C; Construction: Chip; Pins: 2; Termination: Wraparound; Mounting Technology: Surface Mount; Reach SVHC Compliant: Yes; Case/Package: 0805; Package Style: SMTMeter; RoHS Compliant: Yes; Working Voltage: 150V; Min Operating Temperature: -55°C; Technology: THIN FILM; Resistor Type: FIXED RESISTOR; Tolerance: 0.1%
R11 = CMP-00013-1: as R4 on sheet Power and CAN Bus; Termination: Wraparound; Packaging: Tape and Reel; Reach SVHC Compliant: Yes; Pins: 2; Working Voltage: 150V; Construction: Chip; Package Style: SMTMeter; Max Operating Temperature: 155°C; Case/Package: 0805; Resistor Type: FIXED RESISTOR; Mounting Technology: Surface Mount; Technology: THIN FILM; Min Operating Temperature: -55°C; Tolerance: 1%; RoHS Compliant: Yes
U3 = CMP-015-00008-2: CAN Transceiver, 1-Trnsvr, PDSO8; Max Supply Current: 75uA; Power Supplies: 5V; Number of Transceivers: 1; Data Rate: 1000Mbps; Qualification Status: Not Qualified; Time @ Peak Reflow Temperature-Max (s): 40s; Telecom IC Type: INTERFACE CIRCUIT; Package Equivalence Code: SOP8,.25; Package Body Material: Plastic; Technology: CMOS; Min Operating Temperature: -40°C; RoHS Compliant: Yes; Height - Seated (Max): 1.75mm; Terminal Position: DUAL; Surface Mount: Yes; Package Style: SMALL OUTLINEMeter; Terminal Finish: Tin; Terminal Pitch: 1.27mm; JESD-30 Code: R-PDSO-G8; Case/Package: SOP; Nominal Supply Voltage: 5V; Width: 3.9mm; Length: 4.9mm; Peak Reflow Temperature (Cel): 260°C; Package Shape: Rectangular; Channels: 1; Reach SVHC Compliant: Yes; Pins: 8; Temperature Grade: INDUSTRIAL; Terminal Form: Gull Wing; JESD-609 Code: e3; Max Operating Temperature: 85°C; Moisture Sensitivity Level: 1
U4 = CMP-00032-2: Buffer/Inverter Based Peripheral Driver, 1 Driver, 1.8A, PSSO4; Power Supplies: 12V; Driver Number of Bits: 1; Qualification Status: Not Qualified; Max Supply Voltage: 43V; Interface IC Type: BUFFER OR INVERTER BASED PERIPHERAL DRIVER; Turn-Off Delay Time: 200us; Built-in Protections: Over Current,Over Voltage,Under Voltage,TRANSIENT,THERMAL; Nominal Supply Voltage: 5V; Min Supply Voltage: 4.75V; Output Current Flow Direction: SINK; Package Body Material: Plastic; Package Shape: Rectangular; RoHS Compliant: Yes; Moisture Sensitivity Level: 1; Terminal Pitch: 1.14mm; Case/Package: TO-252; Width: 6.22mm; Height - Seated (Max): 2.5mm; Terminal Form: Gull Wing; Min Operating Temperature: -30°C; Terminal Position: SINGLE; Pins: 4; Max Operating Temperature: 85°C; Package Style: SMALL OUTLINEMeter; Channels: 1; Turn-On Delay Time: 200us; Reach SVHC Compliant: No; Surface Mount: Yes; Output Peak Current Limit-Nom: 1.8A; Temperature Grade: COMMERCIAL EXTENDED; Length: 6.5mm
U5 = CMP-00029-1: Power Supply Support Circuit, Fixed, 2 Channel, 2V, PDSO8; Package Equivalence Code: TSSOP8,.1; Power Supplies: 3.3V; Number of Channels: 2; Package Body Material: Plastic; Supply Current-Max (Isup): 1mA; Qualification Status: Not Qualified; Channels: 1; Min Supply Voltage: 3V; Adjustable Threshold: No; Max Supply Voltage: 5.5V; Length: 2.9mm; Temperature Grade: AUTOMOTIVE; Terminal Position: DUAL; Surface Mount: Yes; Terminal Form: Gull Wing; Terminal Pitch: 0.65mm; Case/Package: LSSOP; Moisture Sensitivity Level: 2; JESD-30 Code: R-PDSO-G8; Width: 1.6mm; Min Operating Temperature: -40°C; Throw Configuration: POWER SUPPLY SUPPORT CIRCUIT; Package Shape: Rectangular; Height - Seated (Max): 1.45mm; Terminal Finish: Nickel; JESD-609 Code: e4; Peak Reflow Temperature (Cel): 260°C; Nominal Supply Voltage: 3.3V; Package Style: SMALL OUTLINE, LOW PROFILE, SHRINK PITCHMeter; Pins: 8; RoHS Compliant: Yes; Max Operating Temperature: 125°C; Reach SVHC Compliant: Yes

## Nets that join several sheets
+3.3 V: ESP32_S3 (5 pins), IO (J2.4 J3.2 J7.1 R3.1), Power and CAN Bus (C13.1 R4.2 U2.2), CAN Bus Network (C14.2 R6.1 R7.1 U5.4)
+5.0 V: IO (J6.1 J7.2), Power and CAN Bus (6 pins), CAN Bus Network (C15.1 U3.3)
+24 V: Power and CAN Bus (5 pins), CAN Bus Network (U4.3)
GND: ESP32_S3 (10 pins), IO (14 pins), Power and CAN Bus (13 pins), CAN Bus Network (16 pins)
GPIO1/ADC1_0: ESP32_S3 (J1.39), IO (J8.2)
GPIO2/ADC1_1: ESP32_S3 (J1.38), IO (J8.3)
GPIO3/ADC1_2: ESP32_S3 (J1.15), IO (J7.8)
GPIO8/ADC1_7: ESP32_S3 (J1.12), IO (J7.5)
GPIO9/ADC1_8: ESP32_S3 (J1.17), CAN Bus Network (R7.2 U5.6)
GPIO10/ADC1_9: ESP32_S3 (J1.18), CAN Bus Network (R6.2 U5.5)
GPIO11/ADC2_0: ESP32_S3 (J1.19), CAN Bus Network (U4.2)
GPIO12/ADC2_1: ESP32_S3 (J1.20), CAN Bus Network (U4.4)
GPIO13/ADC2_2: ESP32_S3 (J1.21), IO (J3.4)
GPIO14/ADC2_3: ESP32_S3 (J1.22), IO (J3.3)
GPIO18: ESP32_S3 (J1.11), IO (J7.4)
GPIO19: ESP32_S3 (J1.13), IO (J7.6)
GPIO20: ESP32_S3 (J1.14), IO (J7.7)
GPIO21: ESP32_S3 (J1.23), IO (J9.1)
GPIO38: ESP32_S3 (J1.31), CAN Bus Network (U3.4)
GPIO39: ESP32_S3 (J1.32), CAN Bus Network (U3.1)
GPIO40: ESP32_S3 (J1.33), IO (J8.6)
GPIO41: ESP32_S3 (J1.34), IO (J8.5)
GPIO42: ESP32_S3 (J1.35), IO (J8.4)
GPIO45: ESP32_S3 (J1.26), IO (J6.2)
GPIO47: ESP32_S3 (J1.24), IO (J4.1)
GPIO48: ESP32_S3 (J1.25), IO (R12.1)
RXD: ESP32_S3 (J1.36), IO (J8.8)
SD_CD: ESP32_S3 (J1.4), IO (J2.CD R3.2)
SD_CLK: ESP32_S3 (J1.7), IO (J2.5 R3.10)
SD_CMD: ESP32_S3 (J1.8), IO (J2.3 R3.9)
SD_DAT0: ESP32_S3 (J1.6), IO (J2.7 R3.4)
SD_DAT1: ESP32_S3 (J1.5), IO (J2.8 R3.3)
SD_DAT2: ESP32_S3 (J1.10), IO (J2.1 R3.7)
SD_DAT3_CD: ESP32_S3 (J1.9), IO (J2.2 R3.8)
TXD: ESP32_S3 (J1.37), IO (J8.7)